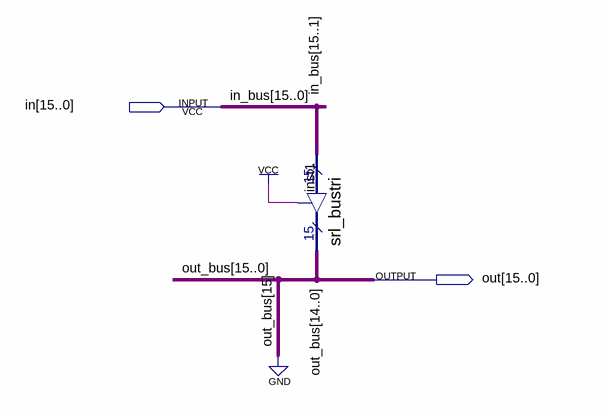
[diagram p0: schematic sheet]
// Quartus schematic SRL.bdf as structural Verilog: 1 symbols, 2 pins
module SRL (
  input  [15:0] in,
  output [15:0] out
);

  srl_bustri inst1 (.enabledt(1'b1), .data(in[15:1]), .tridata(out[14:0]));

  assign out[15] = 1'b0;

  // Other names for the same wires on the sheet: in_bus[15:0] = in; out_bus[14:0] = out[14:0]
endmodule
